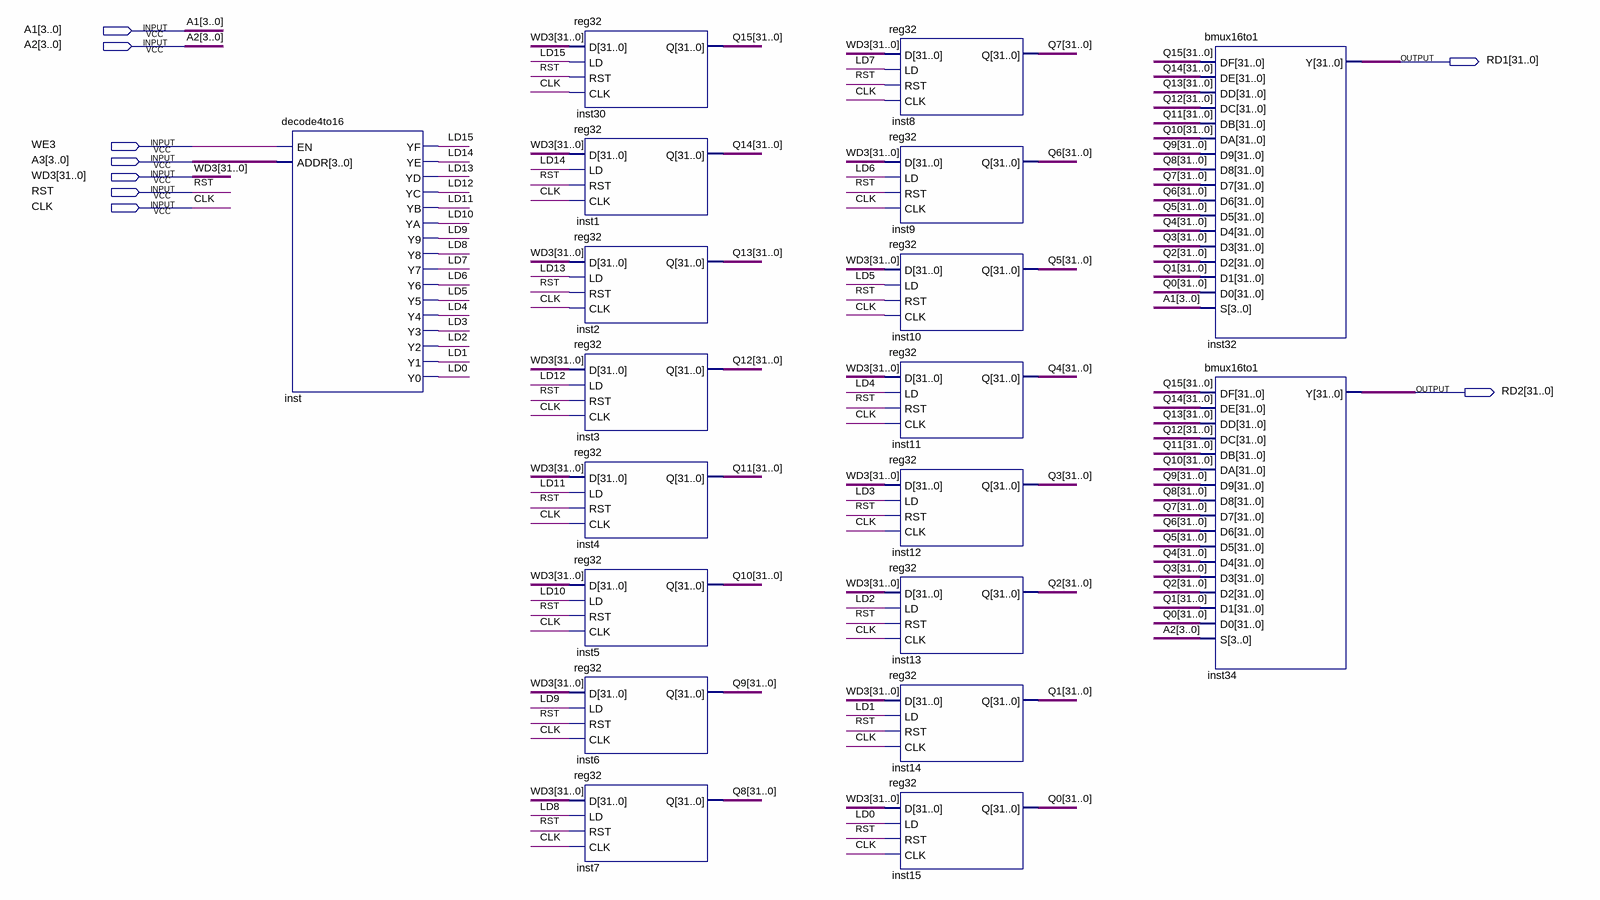
[diagram p0: schematic sheet]
// Quartus schematic regfile.bdf as structural Verilog: 19 symbols, 9 pins
module regfile (
  input  [3:0] A1,
  input  [3:0] A2,
  input  WE3,
  input  [3:0] A3,
  input  [31:0] WD3,
  input  RST,
  input  CLK,
  output [31:0] RD1,
  output [31:0] RD2
);

  wire LD0, LD1, LD2, LD3, LD4, LD5, LD6, LD7, LD8, LD9, LD10, LD11, LD12, LD13, LD14, LD15;
  wire [31:0] Q0, Q1, Q2, Q3, Q4, Q5, Q6, Q7, Q8, Q9, Q10, Q11, Q12, Q13, Q14, Q15;

  decode4to16 inst (
    .EN(WE3), .ADDR(A3), .YF(LD15), .YE(LD14), .YD(LD13), .YC(LD12), .YB(LD11), .YA(LD10), .Y9(LD9),
    .Y8(LD8), .Y7(LD7), .Y6(LD6), .Y5(LD5), .Y4(LD4), .Y3(LD3), .Y2(LD2), .Y1(LD1), .Y0(LD0));
  reg32 inst30 (.D(WD3), .LD(LD15), .RST(RST), .CLK(CLK), .Q(Q15));
  reg32 inst1 (.D(WD3), .LD(LD14), .RST(RST), .CLK(CLK), .Q(Q14));
  reg32 inst2 (.D(WD3), .LD(LD13), .RST(RST), .CLK(CLK), .Q(Q13));
  reg32 inst3 (.D(WD3), .LD(LD12), .RST(RST), .CLK(CLK), .Q(Q12));
  reg32 inst4 (.D(WD3), .LD(LD11), .RST(RST), .CLK(CLK), .Q(Q11));
  reg32 inst5 (.D(WD3), .LD(LD10), .RST(RST), .CLK(CLK), .Q(Q10));
  reg32 inst6 (.D(WD3), .LD(LD9), .RST(RST), .CLK(CLK), .Q(Q9));
  reg32 inst7 (.D(WD3), .LD(LD8), .RST(RST), .CLK(CLK), .Q(Q8));
  reg32 inst8 (.D(WD3), .LD(LD7), .RST(RST), .CLK(CLK), .Q(Q7));
  reg32 inst9 (.D(WD3), .LD(LD6), .RST(RST), .CLK(CLK), .Q(Q6));
  reg32 inst10 (.D(WD3), .LD(LD5), .RST(RST), .CLK(CLK), .Q(Q5));
  reg32 inst11 (.D(WD3), .LD(LD4), .RST(RST), .CLK(CLK), .Q(Q4));
  reg32 inst12 (.D(WD3), .LD(LD3), .RST(RST), .CLK(CLK), .Q(Q3));
  reg32 inst13 (.D(WD3), .LD(LD2), .RST(RST), .CLK(CLK), .Q(Q2));
  reg32 inst14 (.D(WD3), .LD(LD1), .RST(RST), .CLK(CLK), .Q(Q1));
  reg32 inst15 (.D(WD3), .LD(LD0), .RST(RST), .CLK(CLK), .Q(Q0));
  bmux16to1 inst32 (
    .DF(Q15), .DE(Q14), .DD(Q13), .DC(Q12), .DB(Q11), .DA(Q10), .D9(Q9), .D8(Q8), .D7(Q7), .D6(Q6), .D5(Q5),
    .D4(Q4), .D3(Q3), .D2(Q2), .D1(Q1), .D0(Q0), .S(A1), .Y(RD1));
  bmux16to1 inst34 (
    .DF(Q15), .DE(Q14), .DD(Q13), .DC(Q12), .DB(Q11), .DA(Q10), .D9(Q9), .D8(Q8), .D7(Q7), .D6(Q6), .D5(Q5),
    .D4(Q4), .D3(Q3), .D2(Q2), .D1(Q1), .D0(Q0), .S(A2), .Y(RD2));
endmodule
